# Altium schematic sheet CH582SCH_2021-12-11.schdoc
size 295 x 205 mm
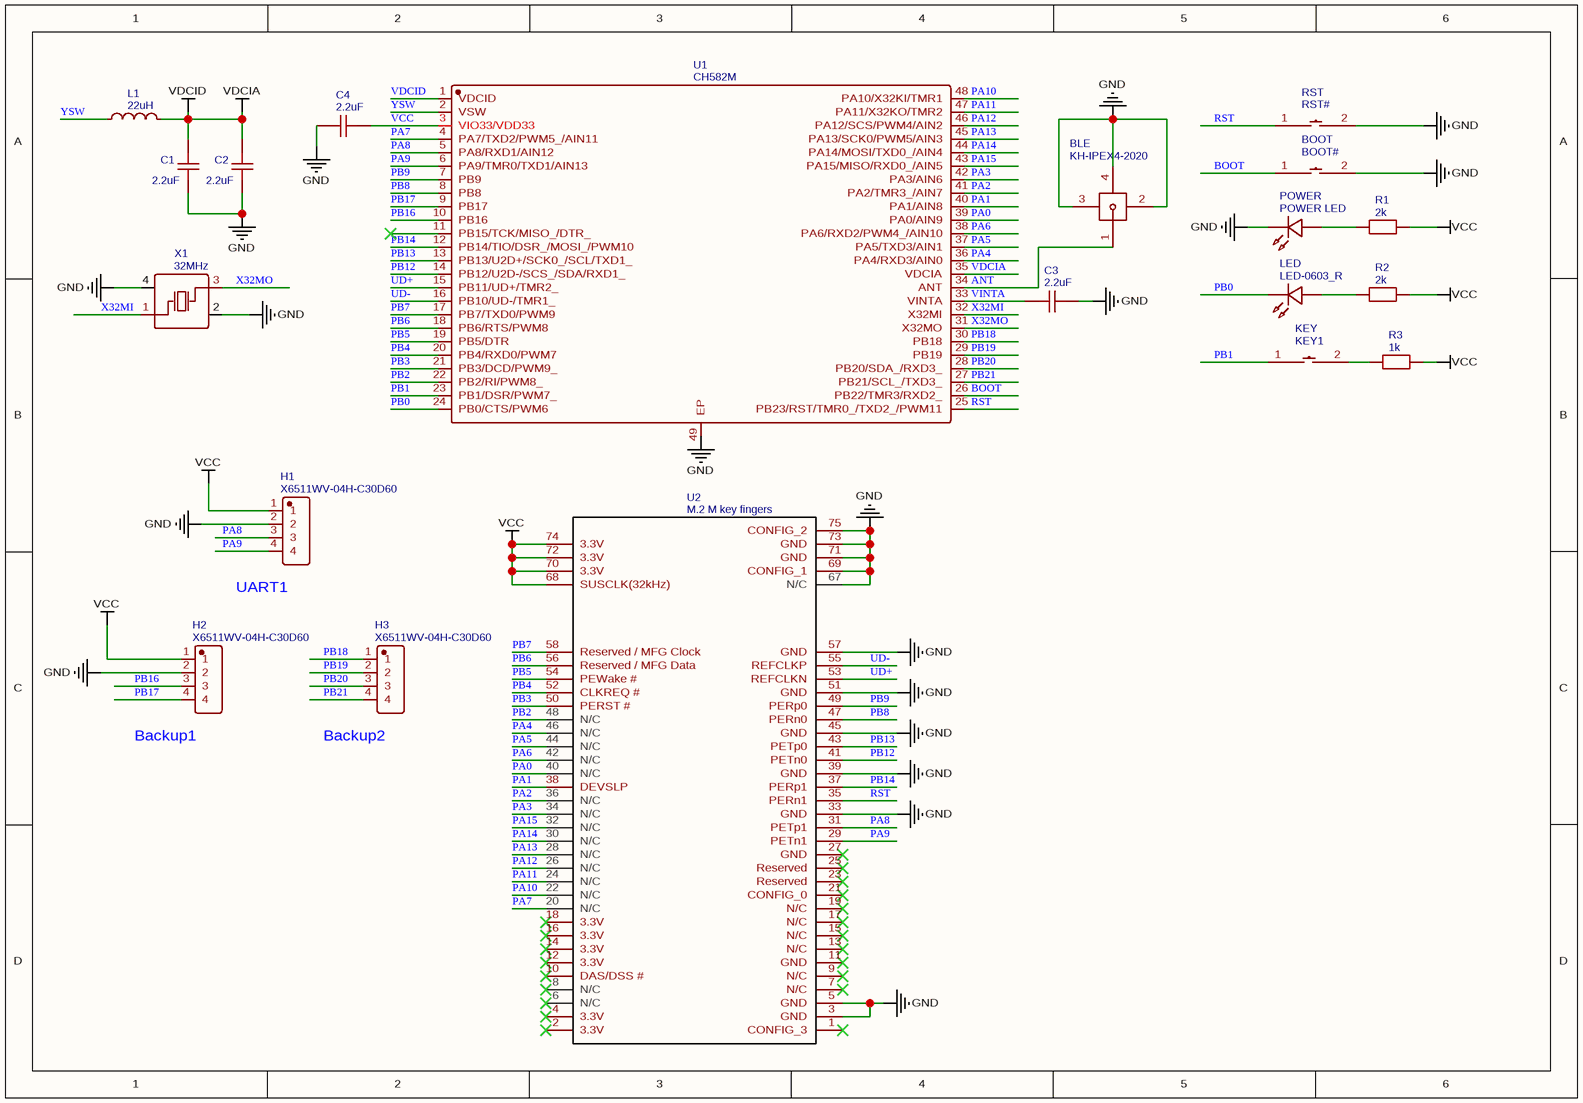
[diagram p0: CH582SCH_2021-12-11.schdoc]

## Parts
BLE  KH-IPEX4-2020  [IPEX4-SMD_4P-L1.8-W1.7-LS2.0-L_KH-IPEX4-2020]
BOOT  BOOT#  [SW-SMD_L4.0-W2.9-LS4.4]
C1  2.2uF  [C0603]
C2  2.2uF  [C0603]
C3  2.2uF  [C0603]
C4  2.2uF  [C0603]
H1  X6511WV-04H-C30D60  [HDR-TH_4P-P2.54-V-M]
H2  X6511WV-04H-C30D60  [HDR-TH_4P-P2.54-V-M]
H3  X6511WV-04H-C30D60  [HDR-TH_4P-P2.54-V-M]
KEY  KEY1  [SW-SMD_L4.0-W2.9-LS4.4]
L1  22uH  [L0603]
LED  LED-0603_R  [LED0603_RED]
POWER  POWER LED  [LED0603_RED]
R1  2k  [R0603]
R2  2k  [R0603]
R3  1k  [R0603]
RST  RST#  [SW-SMD_L4.0-W2.9-LS4.4]
U1  CH582M  [QFN-48_L5.0-W5.0-P0.35-BL-EP]
U2  M.2 M key fingers  [M.2 M KEY FINGERS]
X1  32MHz  [OSC-SMD_4P-L3.2-W2.5-BL]

## Nets
GND: BLE.2 BLE.3 BLE.4 BOOT.2 C1.1 C2.1 C3.1 C4.2 H1.2 H2.2 POWER.2 RST.2 U1.49(EP) U2.3(GND) U2.5(GND) U2.33(GND) U2.39(GND) U2.45(GND) U2.51(GND) U2.57(GND) U2.67(N/C) U2.69(CONFIG_1) U2.71(GND) U2.73(GND) U2.75(CONFIG_2) X1.2(GND) X1.4(GND)
VCC: C4.1 H1.1 H2.1 R1.2 R2.2 R3.2 U1.3(VIO33/VDD33) U2.68(SUSCLK(32kHz)) U2.70(3.3V) U2.72(3.3V) U2.74(3.3V)
VDCIA: C1.2 C2.2 L1.2 U1.1(VDCID) U1.35(VDCIA)  [also labelled VDCID]
ANT: BLE.1 U1.34(ANT)
BOOT: BOOT.1 U1.26(PB22/TMR3/RXD2_)
PA0: U1.39(PA0/AIN9) U2.40(N/C)
PA1: U1.40(PA1/AIN8) U2.38(DEVSLP)
PA2: U1.41(PA2/TMR3_/AIN7) U2.36(N/C)
PA3: U1.42(PA3/AIN6) U2.34(N/C)
PA4: U1.36(PA4/RXD3/AIN0) U2.46(N/C)
PA5: U1.37(PA5/TXD3/AIN1) U2.44(N/C)
PA6: U1.38(PA6/RXD2/PWM4_/AIN10) U2.42(N/C)
PA7: U1.4(PA7/TXD2/PWM5_/AIN11) U2.20(N/C)
PA8: H1.3 U1.5(PA8/RXD1/AIN12) U2.31(PETp1)
PA9: H1.4 U1.6(PA9/TMR0/TXD1/AIN13) U2.29(PETn1)
PA10: U1.48(PA10/X32KI/TMR1) U2.22(N/C)
PA11: U1.47(PA11/X32KO/TMR2) U2.24(N/C)
PA12: U1.46(PA12/SCS/PWM4/AIN2) U2.26(N/C)
PA13: U1.45(PA13/SCK0/PWM5/AIN3) U2.28(N/C)
PA14: U1.44(PA14/MOSI/TXD0_/AIN4) U2.30(N/C)
PA15: U1.43(PA15/MISO/RXD0_/AIN5) U2.32(N/C)
PB0: LED.2 U1.24(PB0/CTS/PWM6)
PB1: KEY.1 U1.23(PB1/DSR/PWM7_)
PB2: U1.22(PB2/RI/PWM8_) U2.48(N/C)
PB3: U1.21(PB3/DCD/PWM9_) U2.50(PERST_#)
PB4: U1.20(PB4/RXD0/PWM7) U2.52(CLKREQ_#)
PB5: U1.19(PB5/DTR) U2.54(PEWake_#)
PB6: U1.18(PB6/RTS/PWM8) U2.56(Reserved_/_MFG_Data)
PB7: U1.17(PB7/TXD0/PWM9) U2.58(Reserved_/_MFG_Clock)
PB8: U1.8(PB8) U2.47(PERn0)
PB9: U1.7(PB9) U2.49(PERp0)
PB12: U1.14(PB12/U2D-/SCS_/SDA/RXD1_) U2.41(PETn0)
PB13: U1.13(PB13/U2D+/SCK0_/SCL/TXD1_) U2.43(PETp0)
PB14: U1.12(PB14/TIO/DSR_/MOSI_/PWM10) U2.37(PERp1)
PB16: H2.3 U1.10(PB16)
PB17: H2.4 U1.9(PB17)
PB18: H3.1 U1.30(PB18)
PB19: H3.2 U1.29(PB19)
PB20: H3.3 U1.28(PB20/SDA_/RXD3_)
PB21: H3.4 U1.27(PB21/SCL_/TXD3_)
RST: RST.1 U1.25(PB23/RST/TMR0_/TXD2_/PWM11) U2.35(PERn1)
UD+: U1.15(PB11/UD+/TMR2_) U2.53(REFCLKN)
UD-: U1.16(PB10/UD-/TMR1_) U2.55(REFCLKP)
VINTA: C3.2 U1.33(VINTA)
X32MI: U1.32(X32MI) X1.1(OSC1)
X32MO: U1.31(X32MO) X1.3(OSC2)
YSW: L1.1 U1.2(VSW)
NetKEY_2: KEY.2 R3.1
NetLED_1: LED.1 R2.1
NetPOWER_1: POWER.1 R1.1

Not connected (* = marked no-connect by the designer): U1 11(PB15/TCK/MISO_/DTR_)*; U2 1(CONFIG_3)* 2(3.3V)* 4(3.3V)* 6(N/C)* 7(N/C)* 8(N/C)* 9(N/C)* 10(DAS/DSS_#)* 11(GND)* 12(3.3V)* 13(N/C)* 14(3.3V)* 15(N/C)* 16(3.3V)* 17(N/C)* 18(3.3V)* 19(N/C)* 21(CONFIG_0)* 23(Reserved)* 25(Reserved)* 27(GND)*

## Notes on the sheet
- (near H1) UART1
- (near H2) Backup1
- (near H3) Backup2

## Library data of the parts
BLE = KH-IPEX4-2020: BOM_Manufacturer: Shenzhen Kinghelm Elec; Contributor: LCSC; BOM_Supplier: LCSC; BOM_Supplier Part: C530666; BOM_Manufacturer Part: KH-IPEX4-2020; BOM_JLCPCB Part Class: Extended Part; spicePre: R; spiceSymbolName: KH-IPEX4-2020
BOOT = BOOT#: BOM_Manufacturer: Korean Hroparts Elec; BOM_Manufacturer Part: K2-1807UN-A4DW-06; Contributor: LCSC; BOM_Supplier: LCSC; BOM_Supplier Part: C961744; BOM_JLCPCB Part Class: Extended Part; spicePre: S; spiceSymbolName: K2-1807UN-A4DW-06
C1-C4 = 2.2uF: nameAlias: Value(F); Contributor: LCEDA_Lib; spicePre: C; spiceSymbolName: C_0603_US
H1-H3 = X6511WV-04H-C30D60: BOM_Manufacturer: XKB Connectivity; Contributor: LCSC; BOM_Supplier: LCSC; BOM_Supplier Part: C706876; BOM_Manufacturer Part: X6511WV-04H-C30D60; BOM_JLCPCB Part Class: Extended Part; spicePre: H; spiceSymbolName: X6511WV-04H-C30D60
KEY = KEY1: BOM_Manufacturer: Korean Hroparts Elec; BOM_Manufacturer Part: K2-1807UN-A4DW-06; Contributor: LCSC; BOM_Supplier: LCSC; BOM_Supplier Part: C961744; BOM_JLCPCB Part Class: Extended Part; spicePre: S; spiceSymbolName: K2-1807UN-A4DW-06
L1 = 22uH: nameAlias: Value(H); Contributor: LCEDA_Lib; spicePre: L; spiceSymbolName: L0603_US
LED = LED-0603_R: BOM_Manufacturer: EVERLIGHT(台湾亿光); BOM_Manufacturer Part: 19-217/R6C-AL1M2VY/3T; Contributor: LCEDA_01; BOM_Supplier Part: C72044; BOM_Supplier: LCSC; spicePre: L; spiceSymbolName: LED-0603_R
POWER = POWER LED: BOM_Manufacturer: EVERLIGHT(台湾亿光); BOM_Manufacturer Part: 19-217/R6C-AL1M2VY/3T; Contributor: LCEDA_01; BOM_Supplier Part: C72044; BOM_Supplier: LCSC; spicePre: L; spiceSymbolName: LED-0603_R
R1 R2 = 2k: nameAlias: Value(Ω); Contributor: LCEDA_Lib; spicePre: R; spiceSymbolName: R_0603_EU
R3 = 1k: nameAlias: Value(Ω); Contributor: LCEDA_Lib; spicePre: R; spiceSymbolName: R_0603_EU
RST = RST#: BOM_Manufacturer: Korean Hroparts Elec; BOM_Manufacturer Part: K2-1807UN-A4DW-06; Contributor: LCSC; BOM_Supplier: LCSC; BOM_Supplier Part: C961744; BOM_JLCPCB Part Class: Extended Part; spicePre: S; spiceSymbolName: K2-1807UN-A4DW-06
U1 = CH582M: Contributor: LCSC; BOM_Supplier: LCSC; BOM_Supplier Part: C2920766; BOM_Manufacturer Part: CH582M; BOM_JLCPCB Part Class: Extended Part; spicePre: U; spiceSymbolName: CH582M
U2 = M.2 M key fingers: Contributor: liuxy67; BOM_Manufacturer Part: M.2 M key fingers; spicePre: U; spiceSymbolName: M.2 M key fingers
X1 = 32MHz: BOM_Manufacturer: TAE; BOM_Manufacturer Part: SMD-3225_4P32MHZ12PF10PPM; nameAlias: Frequency; Contributor: LCSC; BOM_Supplier: LCSC; BOM_Supplier Part: C141794; BOM_JLCPCB Part Class: Extended Part; spicePre: X; spiceSymbolName: SMD-3225_4P32MHZ12PF10PPM